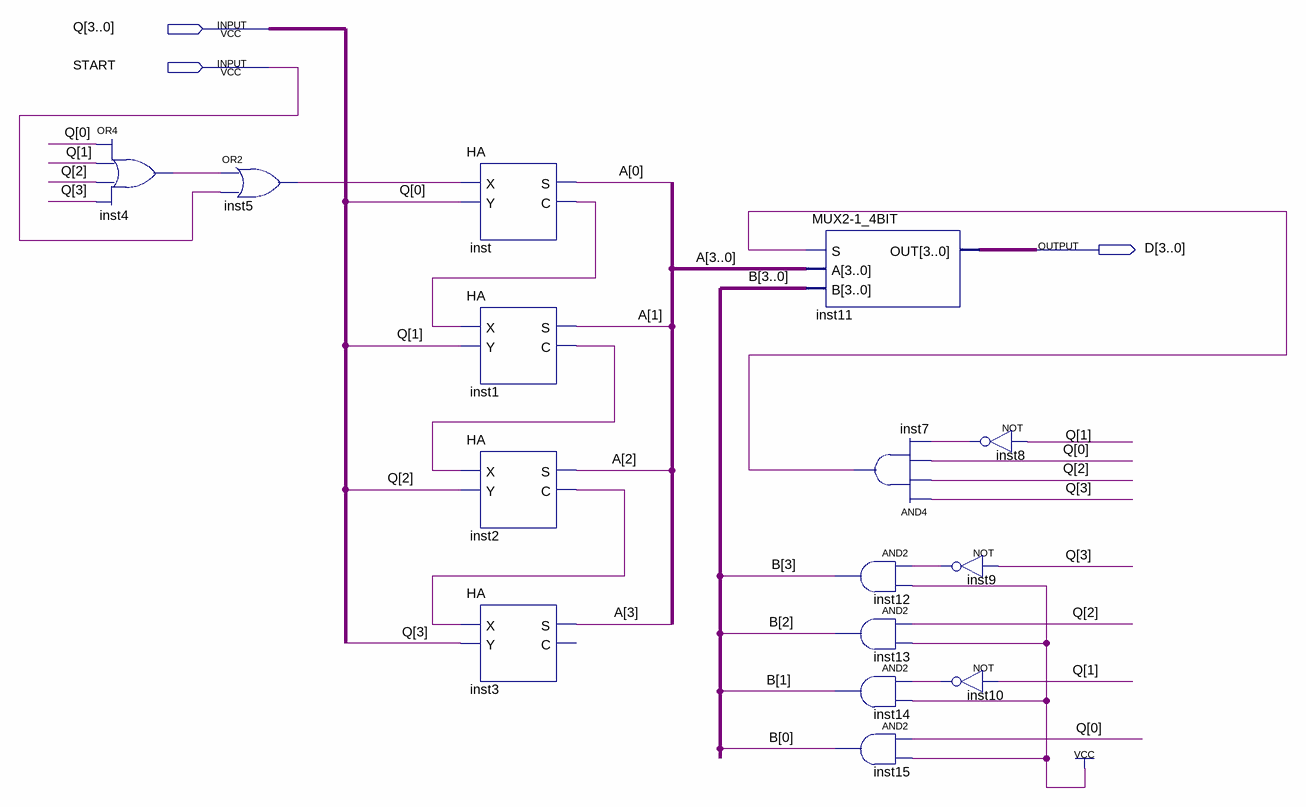
[diagram p0: schematic sheet]
// Quartus schematic COUNTER.bdf as structural Verilog: 15 symbols, 3 pins
module COUNTER (
  input  [3:0] Q,
  input  START,
  output [3:0] D
);

  wire inst1_c, inst2_c, inst4_out, inst5_out, inst7_out, inst8_out, inst9_out, inst10_out, inst_c;
  wire [3:0] A, B;

  or inst4 (inst4_out, Q[0], Q[1], Q[2], Q[3]);
  or inst5 (inst5_out, inst4_out, START);
  HA inst (.X(inst5_out), .Y(Q[0]), .S(A[0]), .C(inst_c));
  HA inst1 (.X(inst_c), .Y(Q[1]), .S(A[1]), .C(inst1_c));
  HA inst2 (.X(inst1_c), .Y(Q[2]), .S(A[2]), .C(inst2_c));
  HA inst3 (.X(inst2_c), .Y(Q[3]), .S(A[3]));  // open: C
  \MUX2-1_4BIT  inst11 (.S(inst7_out), .A(A), .B(B), .OUT(D));
  and inst7 (inst7_out, Q[3], Q[2], Q[0], inst8_out);
  and inst12 (B[3], inst9_out, 1'b1);
  and inst13 (B[2], Q[2], 1'b1);
  and inst14 (B[1], inst10_out, 1'b1);
  and inst15 (B[0], Q[0], 1'b1);
  not inst9 (inst9_out, Q[3]);
  not inst10 (inst10_out, Q[1]);
  not inst8 (inst8_out, Q[1]);
endmodule
